# EAGLE design 16ServosController (EAGLE 7.5.0)
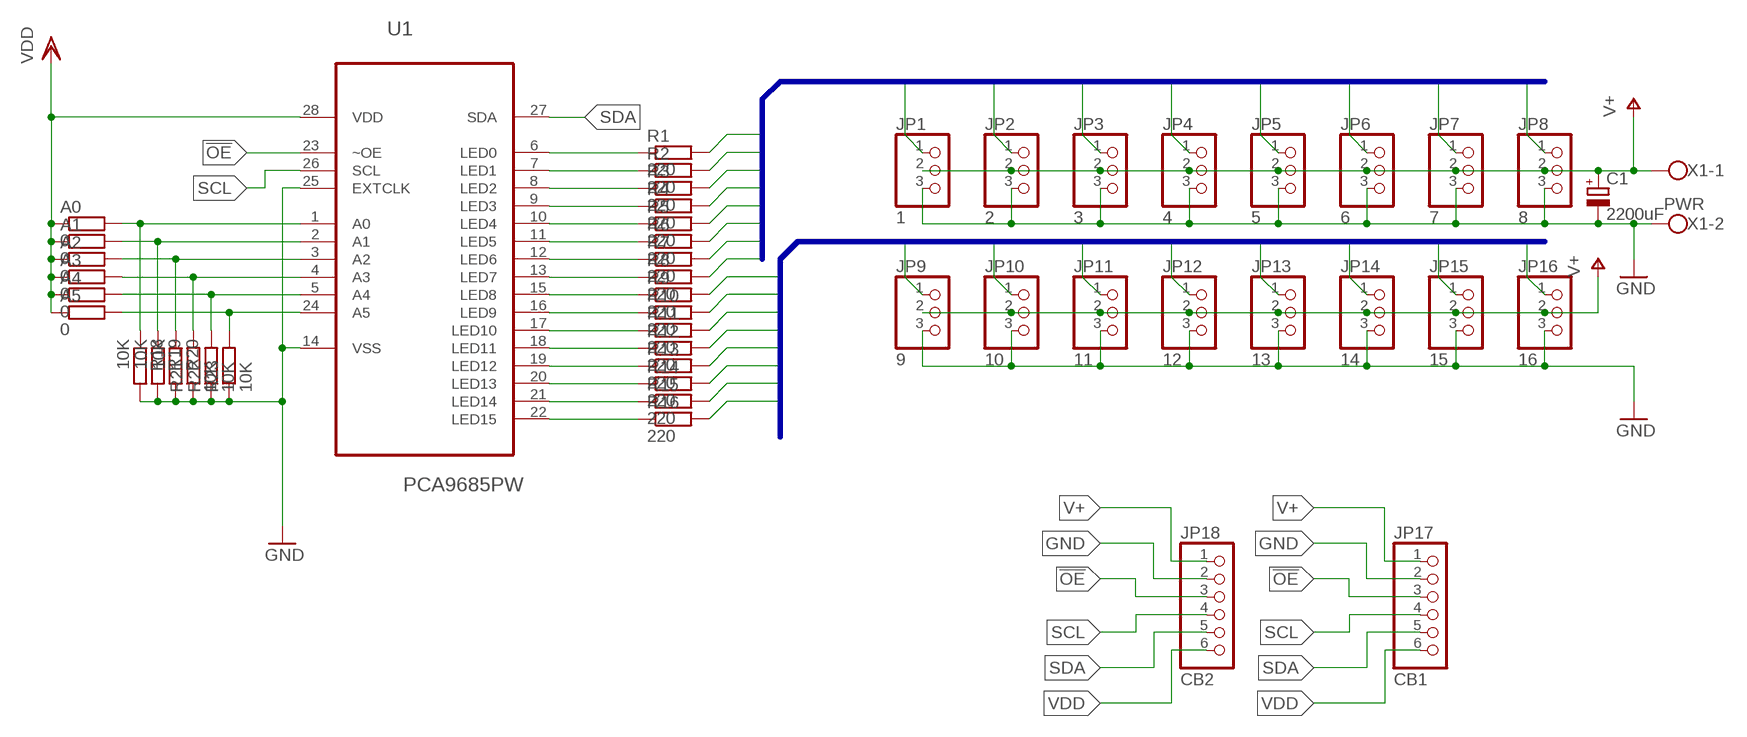
[diagram p0: schematic, sheet 1]

## Parts
A0  0  R-EU_R0805  [R0805]
A1  0  R-EU_R0805  [R0805]
A2  0  R-EU_R0805  [R0805]
A3  0  R-EU_R0805  [R0805]
A4  0  R-EU_R0805  [R0805]
A5  0  R-EU_R0805  [R0805]
C1  2200uF  CPOL-EUE5-6  [E5-6]
JP1  1  PINHD-1X3  [1X03]
JP2  2  PINHD-1X3  [1X03]
JP3  3  PINHD-1X3  [1X03]
JP4  4  PINHD-1X3  [1X03]
JP5  5  PINHD-1X3  [1X03]
JP6  6  PINHD-1X3  [1X03]
JP7  7  PINHD-1X3  [1X03]
JP8  8  PINHD-1X3  [1X03]
JP9  9  PINHD-1X3  [1X03]
JP10  10  PINHD-1X3  [1X03]
JP11  11  PINHD-1X3  [1X03]
JP12  12  PINHD-1X3  [1X03]
JP13  13  PINHD-1X3  [1X03]
JP14  14  PINHD-1X3  [1X03]
JP15  15  PINHD-1X3  [1X03]
JP16  16  PINHD-1X3  [1X03]
JP17  CB1  PINHD-1X6  [1X06]
JP18  CB2  PINHD-1X6  [1X06]
R1  220  R-EU_R0805  [R0805]
R2  220  R-EU_R0805  [R0805]
R3  220  R-EU_R0805  [R0805]
R4  220  R-EU_R0805  [R0805]
R5  220  R-EU_R0805  [R0805]
R6  220  R-EU_R0805  [R0805]
R7  220  R-EU_R0805  [R0805]
R8  220  R-EU_R0805  [R0805]
R9  220  R-EU_R0805  [R0805]
R10  220  R-EU_R0805  [R0805]
R11  220  R-EU_R0805  [R0805]
R12  220  R-EU_R0805  [R0805]
R13  220  R-EU_R0805  [R0805]
R14  220  R-EU_R0805  [R0805]
R15  220  R-EU_R0805  [R0805]
R16  220  R-EU_R0805  [R0805]
R18  10K  R-EU_R0805  [R0805]
R19  10K  R-EU_R0805  [R0805]
R20  10K  R-EU_R0805  [R0805]
R21  10K  R-EU_R0805  [R0805]
R22  10K  R-EU_R0805  [R0805]
R23  10K  R-EU_R0805  [R0805]
U1  PCA9685PW  [SOP65P640X110-28N]
X1  PWR  W237-102  [W237-102]

## Nets
!OE: JP17.3 JP18.3 U1.23(~OE)
A0: A0.2 R18.1 U1.1(A0)
A1: A1.2 R19.1 U1.2(A1)
A2: A2.2 R20.1 U1.3(A2)
A3: A3.2 R21.2 U1.4(A3)
A4: A4.2 R22.2 U1.5(A4)
A5: A5.2 R23.2 U1.24(A5)
GND: C1.- JP1.3 JP2.3 JP3.3 JP4.3 JP5.3 JP6.3 JP7.3 JP8.3 JP9.3 JP10.3 JP11.3 JP12.3 JP13.3 JP14.3 JP15.3 JP16.3 JP17.2 JP18.2 R18.2 R19.2 R20.2 R21.1 R22.1 R23.1 U1.14(VSS) U1.25(EXTCLK) X1.2
N$2: R16.1 U1.22(LED15)
N$3: R1.1 U1.6(LED0)
N$5: R2.1 U1.7(LED1)
N$6: R3.1 U1.8(LED2)
N$7: R4.1 U1.9(LED3)
N$8: R5.1 U1.10(LED4)
N$9: R6.1 U1.11(LED5)
N$10: R7.1 U1.12(LED6)
N$11: R8.1 U1.13(LED7)
N$12: R9.1 U1.15(LED8)
N$13: R10.1 U1.16(LED9)
N$14: R11.1 U1.17(LED10)
N$15: R12.1 U1.18(LED11)
N$16: R13.1 U1.19(LED12)
N$17: R14.1 U1.20(LED13)
N$18: R15.1 U1.21(LED14)
PWM1: JP1.1 R1.2
PWM2: JP2.1 R2.2
PWM3: JP3.1 R3.2
PWM4: JP4.1 R4.2
PWM5: JP5.1 R5.2
PWM6: JP6.1 R6.2
PWM7: JP7.1 R7.2
PWM8: JP8.1 R8.2
PWM9: JP9.1 R9.2
PWM10: JP10.1 R10.2
PWM11: JP11.1 R11.2
PWM12: JP12.1 R12.2
PWM13: JP13.1 R13.2
PWM14: JP14.1 R14.2
PWM15: JP15.1 R15.2
PWM16: JP16.1 R16.2
SCL: JP17.4 JP18.4 U1.26(SCL)
SDA: JP17.5 JP18.5 U1.27(SDA)
V+ [power]: C1.+ JP1.2 JP2.2 JP3.2 JP4.2 JP5.2 JP6.2 JP7.2 JP8.2 JP9.2 JP10.2 JP11.2 JP12.2 JP13.2 JP14.2 JP15.2 JP16.2 JP17.1 JP18.1 X1.1
VDD: A0.1 A1.1 A2.1 A3.1 A4.1 A5.1 JP17.6 JP18.6 U1.28(VDD)

## Buses
PWM[1..8]
PWM[9..16]

## Library data of the parts
A0 A1-A5 R1-R16 R18-R23 = rcl:R-EU_: RESISTOR, European symbol
C1 = rcl:CPOL-EU: POLARIZED CAPACITOR, European symbol
JP1-JP16 = pinhead:PINHD-1X3: PIN HEADER
JP17 JP18 = pinhead:PINHD-1X6: PIN HEADER
U1 = nxp:PCA9685PW: 16-channel, 12-bit PWM Fm+ I2C-bus LED controller; MPN: PCA9685PW; OC_FARNELL: 1854074; OC_NEWARK: 19T6398; PACKAGE: TSSOP-28; SUPPLIER: NXP
X1 = con-wago-500:W237-102: WAGO SCREW CLAMP; MPN: 237-102; OC_FARNELL: unknown; OC_NEWARK: 70K9898

## Net classes
1 power: width 1 mm

## Board
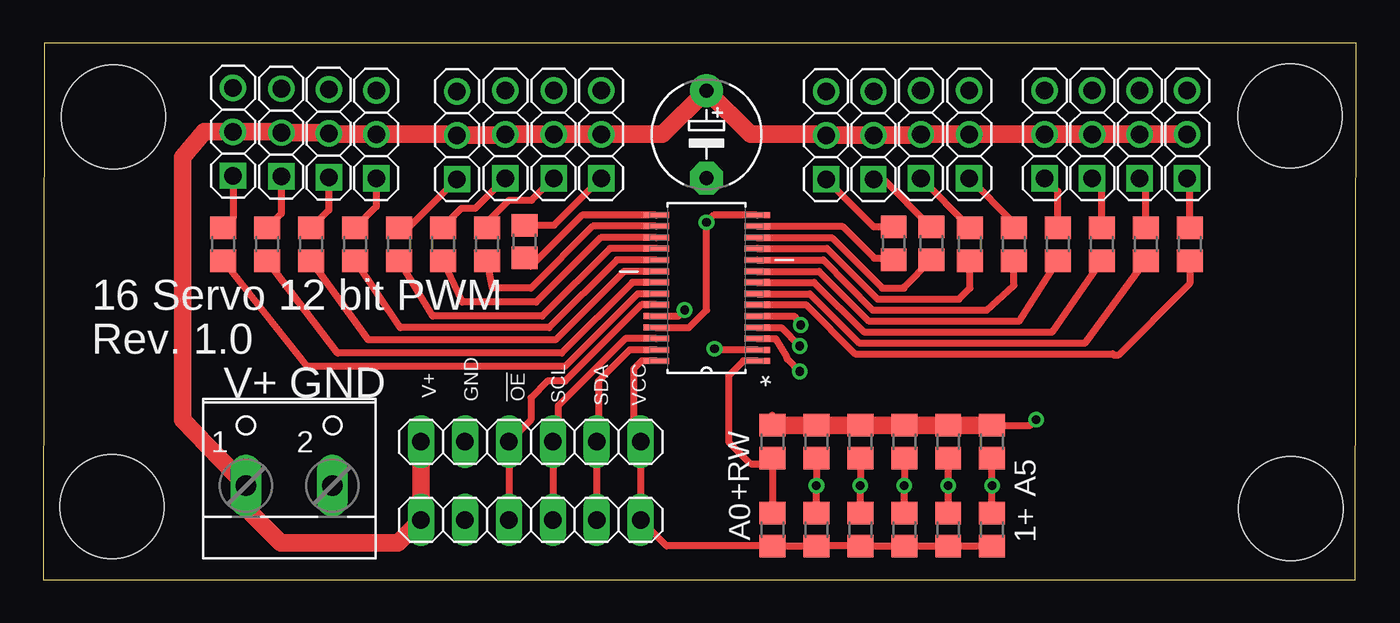
[diagram p1: board, top side]
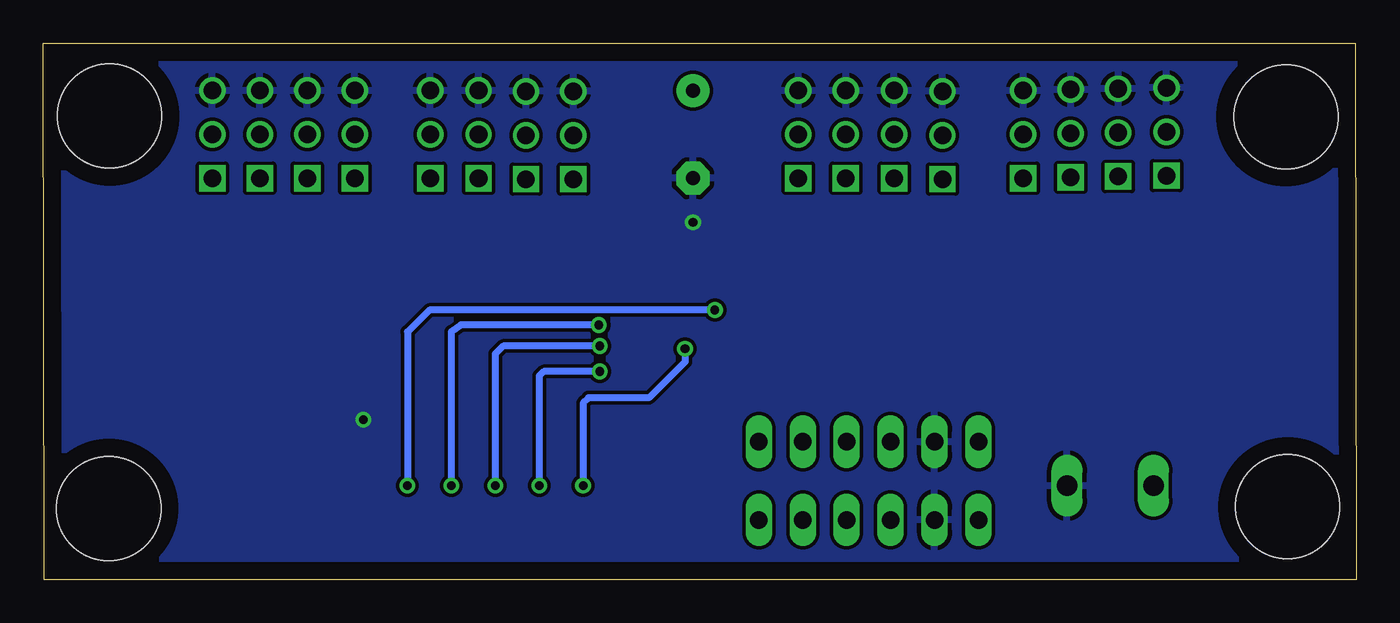
[diagram p2: board, bottom side, seen from below]

Size 75.92 x 31.03 mm. Coordinates in mm from the lower left corner, seen from the top.
Outline: 0,0 75.87,0 75.92,31.03 0.05,31.03 0,0
Copper layers (1*16): Top 0.035mm / dielectric 1.5mm / Bottom 0.035mm
Design rules "default *": minimum track width 10mil, minimum drill 0.2mm, track to track 8mil, track to pad 8mil, pad to pad 8mil, via to via 8mil, smd to smd 8mil, copper to edge 40mil, drill to drill 8mil, minimum pad ring 10mil, minimum via ring 8mil, stop-mask expansion 4mil, vias tented up to drill 0mil, thermal gap 10mil
Holes 6 mm at 4.06,26.77 3.96,4.22 72.14,4.11 72.09,26.82

### Footprints (pad centres in the part's own frame; a part is rotated, then mirrored left to right if it is on the bottom)
R0805 = smd 1.3 x 1.5: 1 -0.95,0; 2 0.95,0
E5-6 = drill 0.813 pad 1.905: + -2.54,0 | drill 0.813 pad 1.905 octagon: - 2.54,0
1X03 = drill 1.016 square: 1 -2.54,0 | drill 1.016: 2 0,0; 3 2.54,0
1X06 = drill 1.016 long: 1 -6.35,0; 2 -3.81,0; 3 -1.27,0; 4 1.27,0; 5 3.81,0; 6 6.35,0
SOP65P640X110-28N = smd 1.473 x 0.356: 1 -2.921,4.216; 2 -2.921,3.581; 3 -2.921,2.921; 4 -2.921,2.286; 5 -2.921,1.626; 6 -2.921,0.965; 7 -2.921,0.33; 8 -2.921,-0.33; 9 -2.921,-0.965; 10 -2.921,-1.626; 11 -2.921,-2.286; 12 -2.921,-2.921; 13 -2.921,-3.581; 14 -2.921,-4.216; 15 2.921,-4.216; 16 2.921,-3.581; 17 2.921,-2.921; 18 2.921,-2.286; 19 2.921,-1.626; 20 2.921,-0.965; 21 2.921,-0.33; 22 2.921,0.33; 23 2.921,0.965; 24 2.921,1.626; 25 2.921,2.286; 26 2.921,2.921; 27 2.921,3.581; 28 2.921,4.216
W237-102 = drill 1.194 long: 1 -2.5,-1.27; 2 2.5,-1.27

### Placement (x,y rotation side)
A0  42.16,2.9 90 top
A1  44.7,2.9 90 top
A2  47.24,2.9 90 top
A3  49.78,2.9 90 top
A4  52.32,2.9 90 top
A5  54.86,2.9 90 top
C1  38.35,25.76 270 top
JP1  66.14,25.76 90 top
JP2  63.4,25.76 90 top
JP3  60.66,25.76 90 top
JP4  57.91,25.76 90 top
JP5  53.54,25.76 90 top
JP6  50.75,25.76 90 top
JP7  48.01,25.7 90 top
JP8  45.26,25.7 90 top
JP9  32.26,25.76 90 top
JP10  29.51,25.76 90 top
JP11  26.72,25.76 90 top
JP12  23.93,25.7 90 top
JP13  19.25,25.76 90 top
JP14  16.51,25.81 90 top
JP15  13.77,25.86 90 top
JP16  10.97,25.91 90 top
JP17  28.19,7.98 0 top
JP18  28.19,3.45 0 top
R1  66.29,19.41 90 top
R2  63.75,19.41 90 top
R3  61.21,19.41 90 top
R4  58.67,19.41 90 top
R5  56.13,19.41 90 top
R6  53.59,19.41 90 top
R7  51.36,19.46 90 top
R8  49.17,19.46 90 top
R9  27.84,19.56 90 top
R10  25.65,19.41 90 top
R11  23.11,19.41 90 top
R12  20.57,19.41 90 top
R13  18.03,19.41 90 top
R14  15.49,19.41 90 top
R15  12.95,19.41 90 top
R16  10.41,19.41 90 top
R18  42.16,7.98 90 top
R19  44.7,7.98 90 top
R20  47.24,7.98 90 top
R21  49.78,7.98 270 top
R22  52.32,7.98 270 top
R23  54.86,7.98 270 top
U1  38.35,16.87 180 top
X1  14.22,6.71 0 top

### Tracks (layer width: path | path; a pad name or v marks a point on that pad's centre or on a via)
!OE
  Top 0.406: JP18.3 JP17.3 28.19,9.25 28.19,10.52 29.16,11.48 30.18,11.48 34.59,15.9 U1.23
A0
  Top 0.406: U1.1 40.49,12.65 39.62,11.79 39.62,7.98 40.89,6.71 41.84,6.71 R18.1 A0.2
A1  (via drill 0.5 pad 0.25)
  Top 0.406: U1.2 38.89,13.28 v38.81,13.36 | R19.1 v44.7,5.44 A1.2
  Bottom 0.406: v38.81,13.36 38.81,12.6 40.89,10.52 44.4,10.52 44.7,10.21 v44.7,5.44
A2  (via drill 0.5 pad 0.25)
  Top 0.406: U1.3 42.34,13.94 42.98,12.9 43.03,12.75 v43.74,12.04 | R20.1 v47.24,5.44 A2.2
  Bottom 0.406: v43.74,12.04 46.99,12.04 47.24,11.79 v47.24,5.44
A3  (via drill 0.5 pad 0.25)
  Top 0.406: U1.4 42.67,14.58 v43.74,13.51 | R21.2 v49.78,5.44 A3.2
  Bottom 0.406: v43.74,13.51 49.33,13.51 49.78,13.06 v49.78,5.44
A4  (via drill 0.5 pad 0.25)
  Top 0.406: A4.2 v52.32,5.44 R22.2 | U1.5 43.43,15.24 v43.79,14.73
  Bottom 0.406: v43.79,14.73 51.77,14.73 52.32,14.33 v52.32,5.44
A5  (via drill 0.5 pad 0.25)
  Top 0.406: A5.2 v54.86,5.44 R23.2 | U1.24 36.73,15.24 v37.08,15.6
  Bottom 0.406: v37.08,15.6 53.59,15.6 54.86,14.33 v54.86,5.44
GND  (via drill 0.5, 0.5 pad 0.25)
  Top 0.406: U1.14 38.76,21.08 v38.35,20.68 38.35,15.6 37.34,14.58 U1.25 | R18.2 42.16,9.5 | R23.1 57.08,8.93 v57.4,9.25
  Top 1: R18.2 R19.2 R20.2 R21.1 R22.1 R23.1
  pour Bottom: 0.25,32.11 75.18,32.11 75.18,-0.91 0.25,-0.91
N$2
  Top 0.406: U1.22 34.37,16.54 30.18,12.34 15.26,12.34 R16.1
N$3
  Top 0.406: U1.6 44.09,15.9 46.94,13.06 61.82,13.06 61.87,13 62.18,13 66.17,16.99 66.29,17.12 R1.1
N$5
  Top 0.406: U1.7 44.32,16.54 47.17,13.69 60.26,13.69 R2.1
N$6
  Top 0.406: U1.8 44.58,17.2 47.45,14.33 58.35,14.33 R3.1
N$7
  Top 0.406: U1.9 44.86,17.83 47.73,14.96 56.45,14.96 R4.1
N$8
  Top 0.406: U1.10 45.11,18.49 47.95,15.6 54.56,15.6 56.13,17.02 R5.1
N$9
  Top 0.406: U1.11 45.31,19.15 48.23,16.23 52.96,16.23 53.59,16.87 R6.1
N$10
  Top 0.406: U1.12 45.59,19.79 48.51,16.87 49.78,16.87 49.78,16.93 R7.1
N$11
  Top 0.406: U1.13 46.2,20.45 48.06,18.59 49.65,18.59 R8.1
N$12
  Top 0.406: U1.15 31.14,21.08 28.19,18.14 28.19,18.25 R9.1
N$13
  Top 0.406: U1.16 31.77,20.45 28.19,16.87 25.97,16.87 R10.1
N$14
  Top 0.406: U1.17 32.23,19.79 28.5,16.05 24.25,16.05 R11.1
N$15
  Top 0.406: U1.18 32.77,19.15 28.85,15.24 22.52,15.24 R12.1
N$16
  Top 0.406: U1.19 33.17,18.49 29.26,14.58 20.64,14.58 R13.1
N$17
  Top 0.406: U1.20 33.58,17.83 29.62,13.87 18.81,13.87 R14.1
N$18
  Top 0.406: U1.21 34.06,17.2 29.97,13.11 17.03,13.11 R15.1
PWM1
  Top 0.406: R1.2 66.29,23.06 JP1.1
PWM2
  Top 0.406: R2.2 63.75,22.86 JP2.1
PWM3
  Top 0.406: R3.2 61.21,22.66 JP3.1
PWM4
  Top 0.406: R4.2 58.67,22.45 JP4.1
PWM5
  Top 0.406: R5.2 56.13,20.62 JP5.1
PWM6
  Top 0.406: R6.2 53.59,20.37 JP6.1
PWM7
  Top 0.406: R7.2 51.32,20.41 48.51,23.22 48.06,23.22 JP7.1
PWM8
  Top 0.406: R8.2 48.02,20.41 JP8.1
PWM9
  Top 0.406: R9.2 29.55,20.51 JP9.1
PWM10
  Top 0.406: R10.2 25.33,20.36 26.92,21.95 28.25,21.95 JP10.1
PWM11
  Top 0.406: R11.2 23.11,20.42 24.18,21.49 24.99,21.49 JP11.1
PWM12
  Top 0.406: R12.2 21.12,20.36 JP12.1
PWM13
  Top 0.406: JP13.1 19.25,21.57 R13.2
PWM14
  Top 0.406: JP14.1 16.51,21.37 R14.2
PWM15
  Top 0.406: JP15.1 13.77,21.17 R15.2
PWM16
  Top 0.406: JP16.1 10.97,20.91 R16.2
SCL
  Top 0.406: JP18.4 JP17.4 29.77,8.28 29.77,10.06 33.66,13.94 U1.26
SDA
  Top 0.406: JP18.5 JP17.5 32.11,8.08 32.11,11.48 33.91,13.28 U1.27
V+
  Top 1: JP17.1 JP18.1 20.52,2.13 13.72,2.13 11.72,4.13 X1.1 8.08,9.23 8.08,24.43 9.3,25.91 JP16.2 13.72,25.91 JP15.2 16.46,25.86 JP14.2 16.71,25.81 16.76,25.76 JP13.2 23.88,25.76 JP12.2 26.67,25.7 JP11.2 JP10.2 JP9.2 35.81,25.76 C1.+ 40.89,25.76 45.21,25.76 JP8.2 JP7.2 50.7,25.7 JP6.2 JP5.2 JP4.2 JP3.2 JP2.2 JP1.2
VDD
  Top 0.406: A5.1 A4.1 A3.1 A2.1 A1.1 A0.1 36.05,1.95 JP18.6 JP17.6 34.14,8.38 34.14,12.19 34.59,12.65 U1.28

### Text on the board
tNames: 16 Servo 12 bit PWM | Rev. 1.0 | V+ | GND | V+ | GND | !OE | SCL | SDA | VCC | +RW | 1+